# Altium schematic sheet CW340_USERIO_SerialSelections.SchDoc: Serial Selection Jumpers
size Letter; Organization: NewAE Technology Inc.; Address1: 1083 Queen St., Suite 196; Address2: Halifax; Address3: NS; Address4: Canada B3H 0B2; SheetApproved: NO
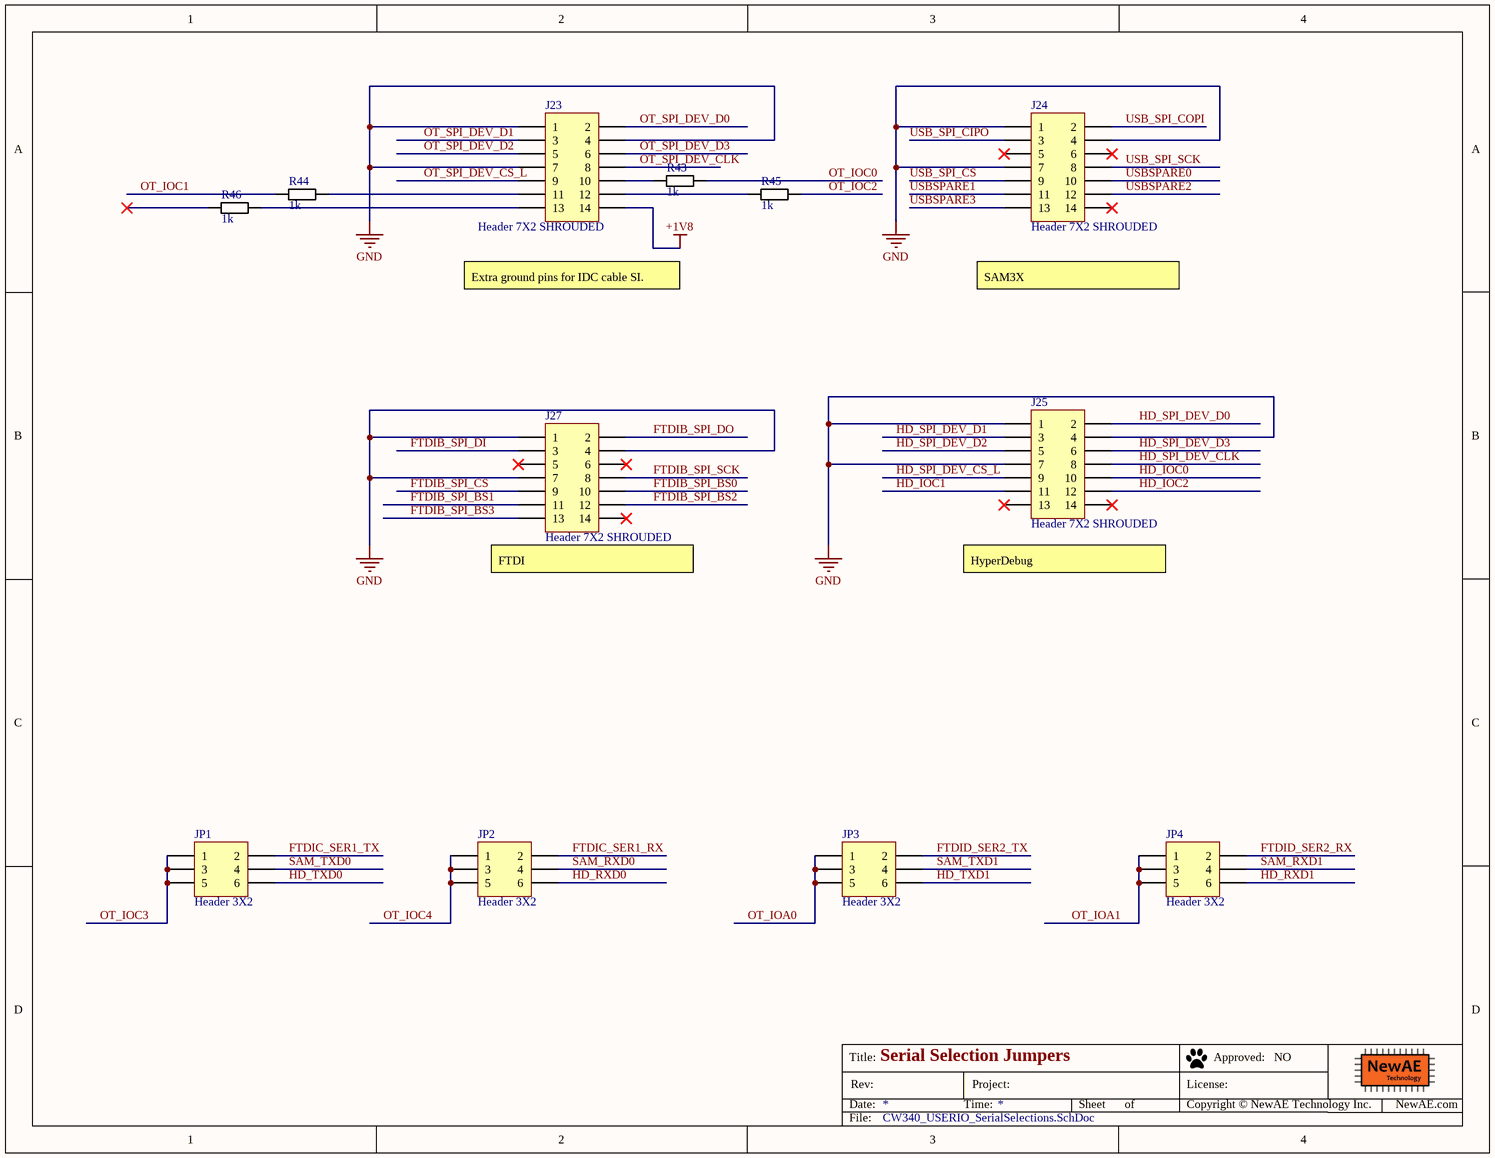
[diagram p0: CW340_USERIO_SerialSelections.SchDoc]

## Parts
J23  Header 7X2 SHROUDED  [HDR2X7]
J24  Header 7X2 SHROUDED  [HDR2X7]
J25  Header 7X2 SHROUDED  [HDR2X7]
J27  Header 7X2 SHROUDED  [HDR2X7]
JP1  Header 3X2  [HDR2X3]
JP2  Header 3X2  [HDR2X3]
JP3  Header 3X2  [HDR2X3]
JP4  Header 3X2  [HDR2X3]
R43  1k  [RESC1608X55N]
R44  1k  [RESC1608X55N]
R45  1k  [RESC1608X55N]
R46  1k  [RESC1608X55N]

## Nets
+1V8: J23.14
GND: J23.1 J23.4 J23.7 J24.1 J24.4 J24.7 J25.1 J25.4 J25.7 J27.1 J27.4 J27.7
FTDIB_SPI_BS0: J27.10
FTDIB_SPI_BS1: J27.11
FTDIB_SPI_BS2: J27.12
FTDIB_SPI_BS3: J27.13
FTDIB_SPI_CS: J27.9
FTDIB_SPI_DI: J27.3
FTDIB_SPI_DO: J27.2
FTDIB_SPI_SCK: J27.8
FTDIC_SER1_RX: JP2.2
FTDIC_SER1_TX: JP1.2
FTDID_SER2_RX: JP4.2
FTDID_SER2_TX: JP3.2
HD_IOC0: J25.10
HD_IOC1: J25.11
HD_IOC2: J25.12
HD_RXD0: JP2.6
HD_RXD1: JP4.6
HD_SPI_DEV_CLK: J25.8
HD_SPI_DEV_CS_L: J25.9
HD_SPI_DEV_D0: J25.2
HD_SPI_DEV_D1: J25.3
HD_SPI_DEV_D2: J25.5
HD_SPI_DEV_D3: J25.6
HD_TXD0: JP1.6
HD_TXD1: JP3.6
OT_IOA0: JP3.1 JP3.3 JP3.5
OT_IOA1: JP4.1 JP4.3 JP4.5
OT_IOC0: R43.2
OT_IOC1: R44.1
OT_IOC2: R45.2
OT_IOC3: JP1.1 JP1.3 JP1.5
OT_IOC4: JP2.1 JP2.3 JP2.5
OT_SPI_DEV_CLK: J23.8
OT_SPI_DEV_CS_L: J23.9
OT_SPI_DEV_D0: J23.2
OT_SPI_DEV_D1: J23.3
OT_SPI_DEV_D2: J23.5
OT_SPI_DEV_D3: J23.6
SAM_RXD0: JP2.4
SAM_RXD1: JP4.4
SAM_TXD0: JP1.4
SAM_TXD1: JP3.4
USB_SPI_CIPO: J24.3
USB_SPI_COPI: J24.2
USB_SPI_CS: J24.9
USB_SPI_SCK: J24.8
USBSPARE0: J24.10
USBSPARE1: J24.11
USBSPARE2: J24.12
USBSPARE3: J24.13
NetJ23_10: J23.10 R43.1
NetJ23_11: J23.11 R44.2
NetJ23_12: J23.12 R45.1
NetJ23_13: J23.13 R46.2

Not connected (* = marked no-connect by the designer): J24 5* 6* 14*; J25 13* 14*; J27 5* 6* 14*; R46 1*

## Notes on the sheet
- Extra ground pins for IDC cable SI.
- SAM3X
- (near J27) FTDI
- (near J25) HyperDebug
- Title:
- Date:
- Rev:
- Time:
- Project:
- Sheet
- of
- License:
- Copyright © NewAE Technology Inc.
- Approved:
- NewAE.com
- File:

## Library data of the parts
J23-J25 J27 = Header 7X2: Header, 7-Pin, Dual row; LatestRevisionDate: 17-Jul-2002; LatestRevisionNote: Re-released for DXP Platform.; Publisher: Altium Limited
JP1-JP4 = Header 3X2: Header, 3-Pin, Dual row; LatestRevisionDate: 17-Jul-2002; LatestRevisionNote: Re-released for DXP Platform.; Publisher: Altium Limited
R43-R46 = RCHIP-1K-0603: 1k res, 0603, 1%, 1/10W; Manufacture 1: Yageo; Manufacture Part Number 1: RC0603FR-071KL; Component Group: Resistor; Case-EIA: 0603; Case-Metric: 1608; Rated Power: 0.1W; Rated Voltage: 75VDC; Part Number: RCHIP-1K-0603; Footprint: 0603; Pin Count: 2; Supplier 1: Digi-Key; Supplier Part Number 1: 311-1.00KHRCT-ND; Value: 1k; Tolerance: 1%; Mounting Technology: SMT; Temperature Range: -55C to 155C; Component Kind: Standard; Component Type: Standard